# Altium schematic sheet LV8121V.SchDoc: Drive de Moteur Brushless LV8121V
size A4; DocumentNumber: 3; Revision: Simon Bouchard, Philippe L.; SheetNumber: 3; SheetTotal: 6; Version: Beta 1.0; : Revision; Conceptor: William Gendron
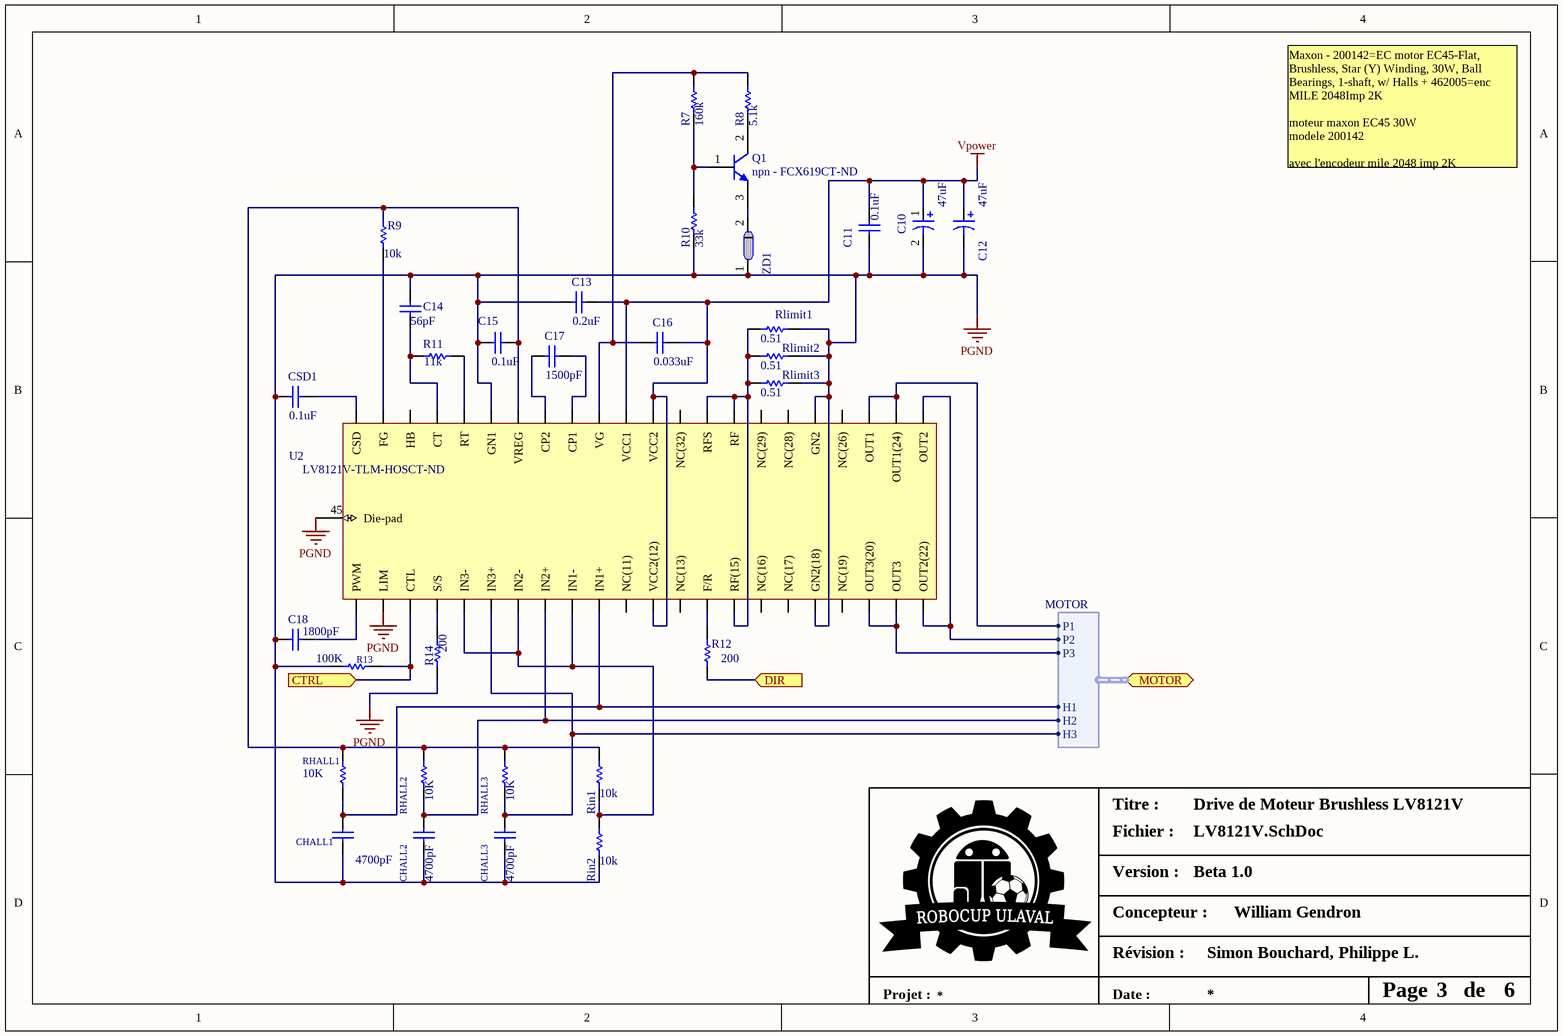
[diagram p0: LV8121V.SchDoc]

## Parts
C10  value 47uF  [sidecap_47uf]  (hidden comment: 47uf - P13464-ND)
C11  value 0.1uF  [c1206]  (hidden comment: .1uf - 399-1249-1-ND)
C12  value 47uF  [sidecap_47uf_rev]  (hidden comment: 47uf - P13464-ND)
C13  value 0.2uF  [c1206]  (hidden comment: 0.2uf - 399-1251-1-ND)
C14  value 56pF  [c1206]  (hidden comment: 56pf - 399-1203-1-ND)
C15  value 0.1uF  [c1206]  (hidden comment: 0.1uf  - 399-1249-1-ND)
C16  value 0.033uF  [c1206]  (hidden comment: 0.033uf - 1276-1289-1-ND)
C17  value 1500pF  [c1206]  (hidden comment: 1500pf - 399-1224-1-ND)
C18  value 1800pF  [c1206]  (hidden comment: 1800pf - 399-1225-1-ND)
CHALL1  value 4700pF  [c1206]  (hidden comment: 4700pf - 445-2333-1-ND)
CHALL2  value 4700pF  [c1206]  (hidden comment: 4700pf -445-2333-1-ND)
CHALL3  value 4700pF  [c1206]  (hidden comment: 4700pf - 445-2333-1-ND)
CSD1  value 0.1uF  [c1206]  (hidden comment: 0.1uf - 399-1249-1-ND)
Q1  npn - FCX619CT-ND  [PLZZ0004CA-A_N]
R7  value 160k  [c1206]  (hidden comment: 160k - 311-160KERCT-ND)
R8  value 5.1k  [c1206]  (hidden comment: 5.1k - P5.10KFCT-ND)
R9  value 10k  [c1206]  (hidden comment: 10K - 311-10.0KFRCT-ND)
R10  value 33k  [c1206]  (hidden comment: 33k - 311-33KERCT-ND)
R11  value 11k  [C1206]  (hidden comment: 11k - 311-11.5KFRCT-ND)
R12  value 200  [c1206]  (hidden comment: 200ohms - 311-200FRCT-ND)
R13  value 100K  [c1206]  (hidden comment: 100k - 311-100KFRCT-ND)
R14  value 200  [c1206]  (hidden comment: 200ohms - 311-200FRCT-ND)
RHALL1  value 10K  [c1206]  (hidden comment: 10k - 311-10.0KFRCT-ND)
RHALL2  value 10K  [c1206]  (hidden comment: 10k - 311-10.0KFRCT-ND)
RHALL3  value 10K  [c1206]  (hidden comment: 10k - 311-10.0KFRCT-ND)
Rin1  value 10k  [c1206]  (hidden comment: 10k - 311-10.0KFRCT-ND)
Rin2  value 10k  [c1206]  (hidden comment: 10k - 311-10.0KFRCT-ND)
Rlimit1  value 0.51  [c1206]  (hidden comment: 0.51ohms - 311-.51LWCT-ND)
Rlimit2  value 0.51  [c1206]  (hidden comment: 0.51 ohms - 311-.51LWCT-ND)
Rlimit3  value 0.51  [c1206]  (hidden comment: 0.51ohms - 311-.51LWCT-ND)
U2  LV8121V-TLM-HOSCT-ND  [LV8121V_update]
ZD1  zener 5.6V - CZRNC55C5V6-G-ND  [c1206]  (value not drawn)

## Ports
CTRL (in), DIR (in), MOTOR (harness MOTOR)

## Harnesses
MOTOR: P1, P2, P3, H1, H2, H3

## Nets
PGND: C10.2 C11.1 C12.2 C13.1 C14.2 C15.1 C18.1 CHALL1.1 CHALL2.1 CHALL3.1 CSD1.1 R10.1 R13.1 R14.1 Rin2.1 Rlimit1.2 Rlimit2.2 Rlimit3.2 U2.2(LIM) U2.18(GN2(18)) U2.27(GN2) U2.39(GN1) U2.45(Die-pad) ZD1.1(Anode)
Vpower: C10.1 C11.2 C12.1 C13.2 C16.2 U2.12(VCC2(12)) U2.33(VCC2) U2.34(VCC1)
CTRL: R13.2 U2.3(CTL) ; port CTRL
DIR: R12.1 ; port DIR
NetC14_1: C14.1 R11.1 U2.41(CT)
NetC15_2: C15.2 R9.2 RHALL1.2 RHALL2.2 RHALL3.2 Rin1.2 U2.38(VREG)
NetC16_1: C16.1 R7.2 R8.2 U2.35(VG)
NetC17_1: C17.1 U2.37(CP2)
NetC17_2: C17.2 U2.36(CP1)
NetC18_2: C18.2 U2.1(PWM)
NetCHALL1_2: CHALL1.2 RHALL1.1 U2.10(IN1+) ; port MOTOR.H1
NetCHALL2_2: CHALL2.2 RHALL2.1 U2.8(IN2+) ; port MOTOR.H2
NetCHALL3_2: CHALL3.2 RHALL3.1 U2.6(IN3+) ; port MOTOR.H3
NetCSD1_2: CSD1.2 U2.44(CSD)
NetQ1_1: Q1.1(B) R7.1 R10.2
NetQ1_2: Q1.2(C) R8.1
NetQ1_3: Q1.3(E) ZD1.2(Cathode)
NetR9_1: R9.1 U2.43(FG)
NetR11_2: R11.2 U2.40(RT)
NetR12_2: R12.2 U2.14(F/R)
NetR14_2: R14.2 U2.4(S/S)
NetRin1_1: Rin1.1 Rin2.2 U2.5(IN3-) U2.7(IN2-) U2.9(IN1-)
NetRlimit1_1: Rlimit1.1 Rlimit2.1 Rlimit3.1 U2.15(RF(15)) U2.30(RF) U2.31(RFS)
NetU2_20: U2.20(OUT3(20)) U2.21(OUT3) ; port MOTOR.P3
NetU2_22: U2.22(OUT2(22)) U2.23(OUT2) ; port MOTOR.P2
NetU2_24: U2.24(OUT1(24)) U2.25(OUT1) ; port MOTOR.P1

Not connected (* = marked no-connect by the designer): U2 11(NC(11)) 13(NC(13)) 16(NC(16)) 17(NC(17)) 19(NC(19)) 26(NC(26)) 28(NC(28)) 29(NC(29)) 32(NC(32)) 42(HB)

## Notes on the sheet
- Maxon - 200142=EC motor EC45-Flat, Brushless, Star (Y) Winding, 30W, Ball
  Bearings, 1-shaft, w/ Halls + 462005=enc MILE 2048Imp 2K
  moteur maxon EC45 30W
  modele 200142
  avec l'encodeur mile 2048 imp 2K
  modèle 462005
- Titre :
- Fichier :
- Version :
- Concepteur :
- Révision :
- Projet :
- Date :
- Page
- de

## Library data of the parts
C10 C12 = Cap Pol1: Polarized Capacitor (Radial); Supplier 1: Digi-Key; Supplier part number 1: P13464-ND
C11 C13-C18 CHALL1-CHALL3 CSD1 = Cap: Capacitor; Supplier 1: Digi-Key
  C11 C15: Supplier Part Number 1: 399-1249-1-ND
  C13: Supplier Part Number 1: 399-1251-1-ND
  C14: Supplier Part Number 1: 399-1203-1-ND
  C16: Supplier Part Number 1: 1276-1289-1-ND
  C17: Supplier Part Number 1: 399-1224-1-ND
  C18: Supplier Part Number 1: 399-1225-1-ND
  CHALL1-CHALL3: Supplier Part Number 1: 445-2333-1-ND
  CSD1: Supplier Part Number 1: 399-1249-1-ND; Supplier 2: Digi-Key; Supplier Part Number 2: 311-1178-1-ND
Q1 = 2SC5964: Silicon NPN Epitaxial, UHF / VHF Wide Band Amplifier; Supplier 1: Digi-Key; Supplier Part Number 1: FCX619CT-ND
R7-R14 RHALL1-RHALL3 Rin1 Rin2 Rlimit1-Rlimit3 = Res1: Resistor; Supplier 1: Digi-Key
  R7: Supplier Part Number 1: 311-160KERCT-ND
  R8: Supplier Part Number 1: P5.10KFCT-ND
  R9: Published: 8-Jun-2000; LatestRevisionDate: 17-Jul-2002; LatestRevisionNote: Re-released for DXP Platform.; PackageReference: AXIAL-0.3; Publisher: Altium Limited; PackageDescription: Axial Device, Thru-Hole; 2 Leads; 0.3 in Pin Spacing; Supplier Part Number 1: 311-10.0KFRCT-ND
  R10: Supplier Part Number 1: 311-33KERCT-ND
  R11: Supplier Part Number 1: 311-11.5KFRCT-ND
  R12 R14: Supplier Part Number 1: 311-200FRCT-ND
  R13: Supplier Part Number 1: 311-100KFRCT-ND
  RHALL1-RHALL3 Rin1 Rin2: Supplier Part Number 1: 311-10.0KFRCT-ND
  Rlimit1-Rlimit3: Supplier Part Number 1: 311-.51LWCT-ND
U2 = LV8121V: Supplier 1: Digi-Key; Supplier part number 1: LV8121V-TLM-HOSCT-ND
ZD1 = Component_1: Supplier 1: Digi-Key; Supplier part number 1: BZT52C5V6-TPMSCT-ND